# Altium project pipe_corner.PrjPCB
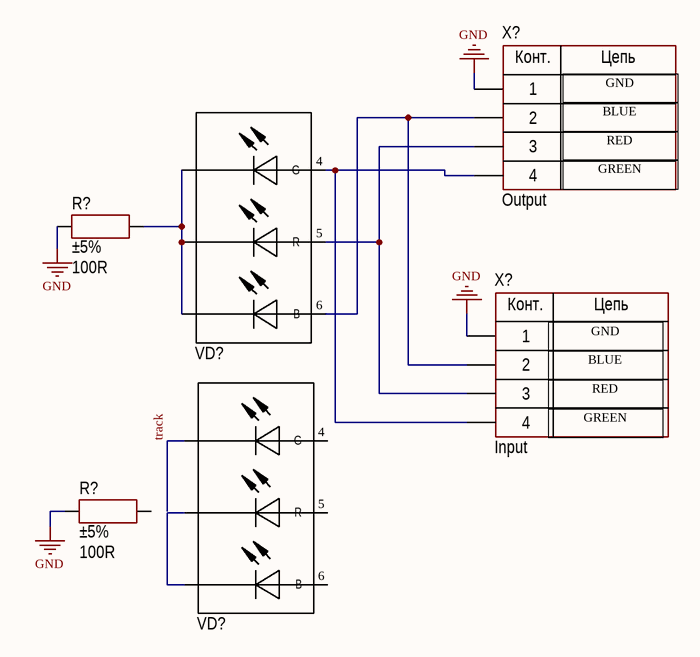
[diagram p0: pipe_corner_schematic.SchDoc]
1 sheet, 6 parts. Net scope: global (net labels, ports and power ports of the same name join across sheets).
Board files: pipe_corner_pcb.PcbDoc, v3.PcbDoc

## Sheet pipe_corner_schematic.SchDoc
size A4

### Parts
(Parts that share a designator on the sheet are numbered #1, #2 ... from top to bottom, then left to right.)
R?#1  value 100R  Tolerance: ±5%  [RES: 0603]
R?#2  value 100R  Tolerance: ±5%  [RES: 0603]
VD?#1  VD?  [RGB]  (value not drawn)
VD?#2  VD?  [RGB]  (value not drawn)
X?#1  CommentText: Output  [CON: PBS-4 R]
X?#2  CommentText: Input  [4PLS RIGHT ANGLE 2]

### Nets
GND: R?#1.2 R?#2.2 X?#1.1 X?#2.1
track: VD?#2.1(G)
NetR?#1_1: R?#1.1 VD?#1.1(G) VD?#1.2(G) VD?#1.3(G)
NetVD?#1_4: VD?#1.4(G) X?#1.4 X?#2.4
NetVD?#1_5: VD?#1.5(R) X?#1.3 X?#2.3
NetVD?#1_6: VD?#1.6(B) X?#1.2 X?#2.2
NetVD?#2_2: VD?#2.2(G) VD?#2.3(G)

Not connected (* = marked no-connect by the designer): R?#2 1; VD?#2 4(G) 5(R) 6(B)

### Notes on the sheet
- GND
- BLUE
- RED
- GREEN
- (near X?#2) GND
- (near X?#2) BLUE
- (near X?#2) RED
- (near X?#2) GREEN
- (in symbol PBS-4) Конт.; Цепь
- (in symbol PLS-4) Конт.; Цепь

### Library data of the parts
R?#1 R?#2 = Resistor_0603: Manufacturer: Yageo; PartNumber: RC0603JR-07100RL; ValueManufacturerPartNumber: Resistor film, 100R, ±5%, 0603, 0.1W, -55...+125°C; TypeResistor: Resistor film; Power: 0.1W; Package: 0603; HelpURL: https://www.digikey.com/product-detail/en/yageo/RC0603JR-07100RL/311-100GRCT-ND/729644; Temperature: -55...+125°C
VD?#1 VD?#2 = RGB
X?#1 = PBS-4: Manufacturer: Connfly; ValueManufacturerPartNumber: Connector, 4pin, 2.54mm, 500VAC, 3A; TypeConnector: Connector; VoltageMax: 500VAC; Pitch: 2.54mm; CurrentMax: 3A; Multichannel: 4pin; HelpURL: https://www.chipdip.ru/product/pbs-4; PartNumber: PBS-4
X?#2 = PLS-4: Manufacturer: Connfly; ValueManufacturerPartNumber: Connector, 4pin, 2.54mm, 500VAC, 3A; TypeConnector: Connector; VoltageMax: 500VAC; Pitch: 2.54mm; CurrentMax: 3A; Multichannel: 4pin; HelpURL: https://www.chipdip.ru/product/pls-4; PartNumber: PLS-4